# EAGLE design Wiegand (EAGLE 6.5.0)
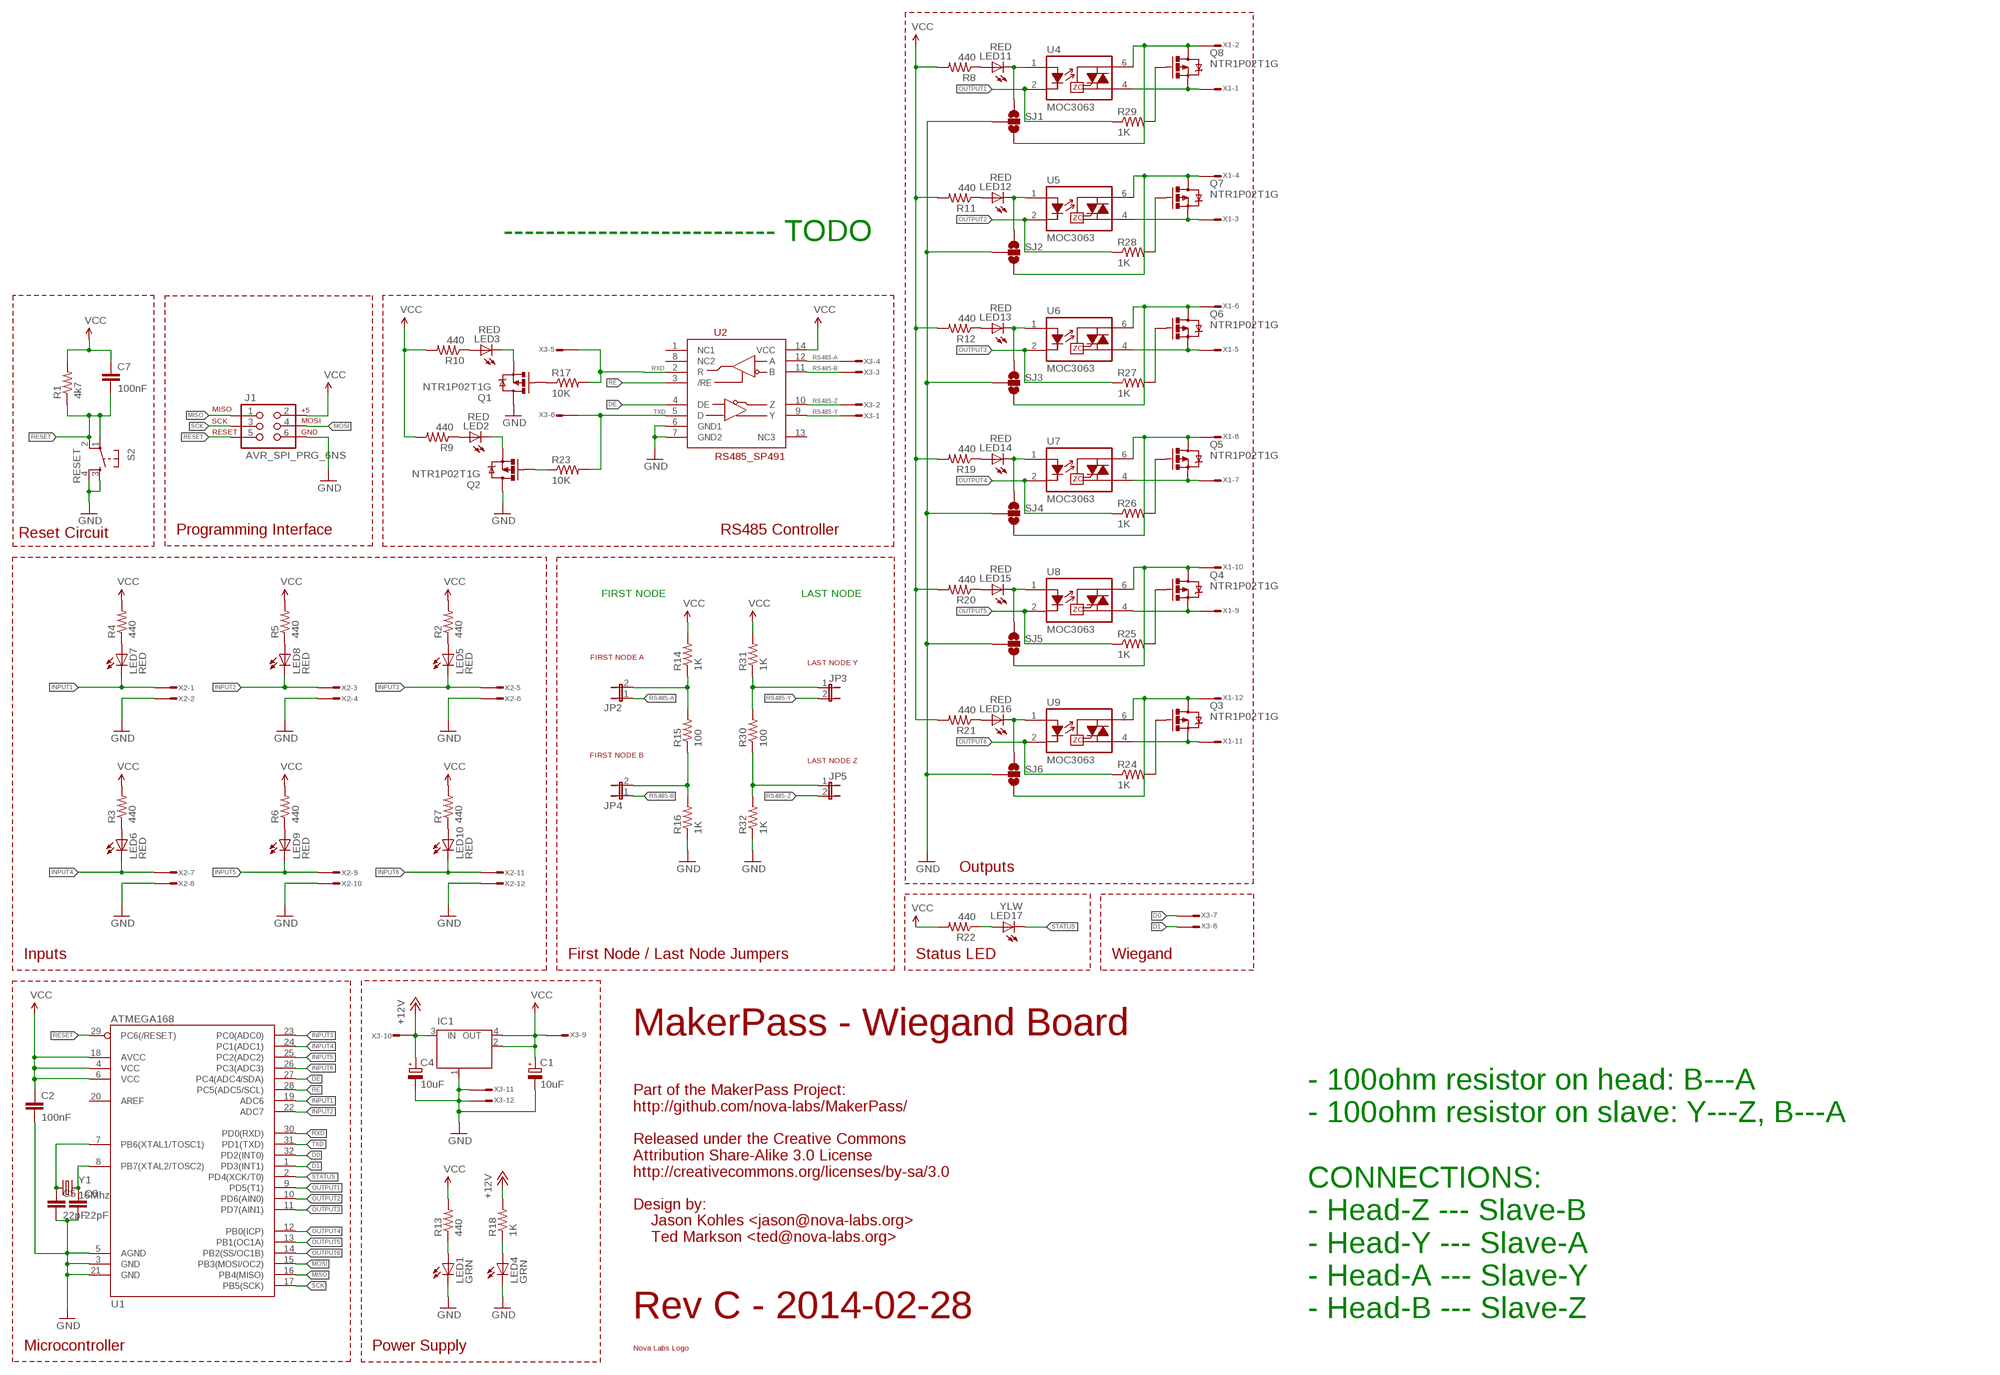
[diagram p0: schematic, sheet 1]

## Parts
C1  10uF  CPOL-EUD  [PANASONIC_D]
C2  100nF  CAP0603-CAP  [0603-CAP]
C4  10uF  CPOL-EUD  [PANASONIC_D]
C5  22pF  CAP0603-CAP  [0603-CAP]
C6  22pF  CAP0603-CAP  [0603-CAP]
C7  100nF  CAP0603-CAP  [0603-CAP]
IC1  MC33269ST-3.3T3  [SOT223]
J1  AVR_SPI_PRG_6NS  [2X3-NS]
JP2  JUMPER-2PTH  [1X02]
JP3  JUMPER-2PTH  [1X02]
JP4  JUMPER-2PTH  [1X02]
JP5  JUMPER-2PTH  [1X02]
LED1  GRN  LED-0805  [LED-805]
LED2  RED  LED-0805  [LED-805]
LED3  RED  LED-0805  [LED-805]
LED4  GRN  LED-0805  [LED-805]
LED5  RED  LED-0805  [LED-805]
LED6  RED  LED-0805  [LED-805]
LED7  RED  LED-0805  [LED-805]
LED8  RED  LED-0805  [LED-805]
LED9  RED  LED-0805  [LED-805]
LED10  RED  LED-0805  [LED-805]
LED11  RED  LED-0805  [LED-805]
LED12  RED  LED-0805  [LED-805]
LED13  RED  LED-0805  [LED-805]
LED14  RED  LED-0805  [LED-805]
LED15  RED  LED-0805  [LED-805]
LED16  RED  LED-0805  [LED-805]
LED17  YLW  LED-0805  [LED-805]
Q1  NTR1P02T1G  MOSFET-PCHANNELSMD  [SOT23-3]
Q2  NTR1P02T1G  MOSFET-PCHANNELSMD  [SOT23-3]
Q3  NTR1P02T1G  MOSFET-PCHANNELSMD  [SOT23-3]
Q4  NTR1P02T1G  MOSFET-PCHANNELSMD  [SOT23-3]
Q5  NTR1P02T1G  MOSFET-PCHANNELSMD  [SOT23-3]
Q6  NTR1P02T1G  MOSFET-PCHANNELSMD  [SOT23-3]
Q7  NTR1P02T1G  MOSFET-PCHANNELSMD  [SOT23-3]
Q8  NTR1P02T1G  MOSFET-PCHANNELSMD  [SOT23-3]
R1  4k7  RESISTOR0603-RES  [0603-RES]
R2  440  RESISTOR0603-RES  [0603-RES]
R3  440  RESISTOR0603-RES  [0603-RES]
R4  440  RESISTOR0603-RES  [0603-RES]
R5  440  RESISTOR0603-RES  [0603-RES]
R6  440  RESISTOR0603-RES  [0603-RES]
R7  440  RESISTOR0603-RES  [0603-RES]
R8  440  RESISTOR0603-RES  [0603-RES]
R9  440  RESISTOR0603-RES  [0603-RES]
R10  440  RESISTOR0603-RES  [0603-RES]
R11  440  RESISTOR0603-RES  [0603-RES]
R12  440  RESISTOR0603-RES  [0603-RES]
R13  440  RESISTOR0603-RES  [0603-RES]
R14  1K  RESISTOR0603-RES  [0603-RES]
R15  100  RESISTOR0603-RES  [0603-RES]
R16  1K  RESISTOR0603-RES  [0603-RES]
R17  10K  RESISTOR0603-RES  [0603-RES]
R18  1K  RESISTOR0603-RES  [0603-RES]
R19  440  RESISTOR0603-RES  [0603-RES]
R20  440  RESISTOR0603-RES  [0603-RES]
R21  440  RESISTOR0603-RES  [0603-RES]
R22  440  RESISTOR0603-RES  [0603-RES]
R23  10K  RESISTOR0603-RES  [0603-RES]
R24  1K  RESISTOR0603-RES  [0603-RES]
R25  1K  RESISTOR0603-RES  [0603-RES]
R26  1K  RESISTOR0603-RES  [0603-RES]
R27  1K  RESISTOR0603-RES  [0603-RES]
R28  1K  RESISTOR0603-RES  [0603-RES]
R29  1K  RESISTOR0603-RES  [0603-RES]
R30  100  RESISTOR0603-RES  [0603-RES]
R31  1K  RESISTOR0603-RES  [0603-RES]
R32  1K  RESISTOR0603-RES  [0603-RES]
S2  RESET  TAC_SWITCHSMD  [TACTILE_SWITCH_SMD]
SJ1  SOLDERJUMPER_2WAY-TRACE1&2&3  [SJ_3_WIRE1&2&3]
SJ2  SOLDERJUMPER_2WAY-TRACE1&2&3  [SJ_3_WIRE1&2&3]
SJ3  SOLDERJUMPER_2WAY-TRACE1&2&3  [SJ_3_WIRE1&2&3]
SJ4  SOLDERJUMPER_2WAY-TRACE1&2&3  [SJ_3_WIRE1&2&3]
SJ5  SOLDERJUMPER_2WAY-TRACE1&2&3  [SJ_3_WIRE1&2&3]
SJ6  SOLDERJUMPER_2WAY-TRACE1&2&3  [SJ_3_WIRE1&2&3]
U1  ATMEGA168  [TQFP32-08]
U2  RS485_SP491  [SOIC-14]
U4  MOC3063  MOC3063S  [DIP8SMD]
U5  MOC3063  MOC3063S  [DIP8SMD]
U6  MOC3063  MOC3063S  [DIP8SMD]
U7  MOC3063  MOC3063S  [DIP8SMD]
U8  MOC3063  MOC3063S  [DIP8SMD]
U9  MOC3063  MOC3063S  [DIP8SMD]
X1  CON-1X12-TERMBLOCK-3.5MM  [CON-1X12-TERMBLOCK-3.5MM]
X2  CON-1X12-TERMBLOCK-3.5MM  [CON-1X12-TERMBLOCK-3.5MM]
X3  CON-1X12-TERMBLOCK-3.5MM  [CON-1X12-TERMBLOCK-3.5MM]
X4  NOVA-LABS-LOGO-SILK-400MIL  [NOVA-LABS-LOGO-SILK-400MIL]
Y1  16Mhz  CRYSTALSMD  [HC49UP]

## Nets
+12V [power]: C4.+ IC1.3(IN) R18.2 X3.10
D0: U1.32(PD2(INT0)) X3.7
D1: U1.1(PD3(INT1)) X3.8
DE: U1.27(PC4(ADC4/SDA)) U2.4(DE)
GND: C1.- C2.2 C4.- C5.2 C6.2 IC1.1(GND/ADJ) J1.6 LED1.C LED4.C Q1.3(D) Q2.3(D) R16.1 R32.1 S2.3 S2.4 SJ1.2 SJ2.2 SJ3.2 SJ4.2 SJ5.2 SJ6.2 U1.3(GND) U1.5(AGND) U1.21(GND) U2.6(GND1) U2.7(GND2) X2.2 X2.4 X2.6 X2.8 X2.10 X2.12 X3.11 X3.12
INPUT1: LED7.C U1.19(ADC6) X2.1
INPUT2: LED8.C U1.22(ADC7) X2.3
INPUT3: LED5.C U1.23(PC0(ADC0)) X2.5
INPUT4: LED6.C U1.24(PC1(ADC1)) X2.7
INPUT5: LED9.C U1.25(PC2(ADC2)) X2.9
INPUT6: LED10.C U1.26(PC3(ADC3)) X2.11
MISO: J1.1 U1.16(PB4(MISO))
MOSI: J1.4 U1.15(PB3(MOSI/OC2))
N$1: LED1.A R13.1
N$3: Q4.2(S) U8.4(T2) X1.9
N$4: Q4.3(D) SJ5.3 U8.6(T1) X1.10
N$5: LED5.A R2.1
N$6: JP5.1 R30.1 R32.2
N$7: JP3.1 R30.2 R31.1
N$8: LED4.A R18.1
N$9: LED3.C Q1.2(S)
N$10: LED6.A R3.1
N$11: LED7.A R4.1
N$12: LED8.A R5.1
N$13: LED9.A R6.1
N$14: LED10.A R7.1
N$15: LED11.C SJ1.1 U4.1(A)
N$16: LED11.A R8.1
N$18: Q8.3(D) SJ1.3 U4.6(T1) X1.2
N$19: Q7.2(S) U5.4(T2) X1.3
N$20: Q7.3(D) SJ2.3 U5.6(T1) X1.4
N$21: LED12.A R11.1
N$22: LED12.C SJ2.1 U5.1(A)
N$23: Q6.2(S) U6.4(T2) X1.5
N$24: Q6.3(D) SJ3.3 U6.6(T1) X1.6
N$25: LED13.A R12.1
N$26: LED2.A R9.1
N$27: LED3.A R10.1
N$28: LED13.C SJ3.1 U6.1(A)
N$29: Q5.2(S) U7.4(T2) X1.7
N$30: Q5.3(D) SJ4.3 U7.6(T1) X1.8
N$31: LED14.A R19.1
N$32: LED14.C SJ4.1 U7.1(A)
N$33: LED2.C Q2.2(S)
N$34: Q1.1(G) R17.1
N$35: LED15.A R20.1
N$36: LED15.C SJ5.1 U8.1(A)
N$37: Q3.3(D) SJ6.3 U9.6(T1) X1.12
N$38: Q3.2(S) U9.4(T2) X1.11
N$39: LED16.A R21.1
N$40: LED16.C SJ6.1 U9.1(A)
N$41: LED17.A R22.1
N$42: Q2.1(G) R23.1
N$43: Q4.1(G) R25.2
N$44: Q5.1(G) R26.2
N$48: Q6.1(G) R27.2
N$49: Q7.1(G) R28.2
N$50: Q8.1(G) R29.2
N$51: JP2.2 R14.1 R15.2
N$52: JP4.2 R15.1 R16.2
N$53: Q8.2(S) U4.4(T2) X1.1
N$100: C5.1 U1.7(PB6(XTAL1/TOSC1)) Y1.1
N$101: C6.1 U1.8(PB7(XTAL2/TOSC2)) Y1.2
N$435: Q3.1(G) R24.2
OUTPUT1: R29.1 U1.9(PD5(T1)) U4.2(K)
OUTPUT2: R28.1 U1.10(PD6(AIN0)) U5.2(K)
OUTPUT3: R27.1 U1.11(PD7(AIN1)) U6.2(K)
OUTPUT4: R26.1 U1.12(PB0(ICP)) U7.2(K)
OUTPUT5: R25.1 U1.13(PB1(OC1A)) U8.2(K)
OUTPUT6: R24.1 U1.14(PB2(SS/OC1B)) U9.2(K)
RE: U1.28(PC5(ADC5/SCL)) U2.3(/RE)
RESET: C7.2 J1.5 R1.1 S2.1 S2.2 U1.29(PC6(/RESET))
RS485-A: JP2.1 U2.12(A) X3.4
RS485-B: JP4.1 U2.11(B) X3.3
RS485-Y: JP3.2 U2.9(Y) X3.1
RS485-Z: JP5.2 U2.10(Z) X3.2
RXD: R17.2 U1.30(PD0(RXD)) U2.2(R) X3.5
SCK: J1.3 U1.17(PB5(SCK))
STATUS: LED17.C U1.2(PD4(XCK/T0))
TXD: R23.2 U1.31(PD1(TXD)) U2.5(D) X3.6
VCC: C1.+ C2.1 C7.1 IC1.2(OUT) IC1.4(OUT) J1.2 R1.2 R2.2 R3.2 R4.2 R5.2 R6.2 R7.2 R8.2 R9.2 R10.2 R11.2 R12.2 R13.2 R14.2 R19.2 R20.2 R21.2 R22.2 R31.2 U1.4(VCC) U1.6(VCC) U1.18(AVCC) U2.14(VCC) X3.9
Unconnected: U1.20(AREF) U2.1(NC1) U2.8(NC2) U2.13(NC3)

## Notes on the sheet
- -------------------------- TODO
- Reset Circuit | Programming Interface | RS485 Controller
- FIRST NODE | LAST NODE
- FIRST NODE A
- LAST NODE Y
- FIRST NODE B
- LAST NODE Z
- Outputs
- Inputs | First Node / Last Node Jumpers | Status LED | Wiegand
- MakerPass - Wiegand Board
- Part of the MakerPass Project:
  http://github.com/nova-labs/MakerPass/
  
  Released under the Creative Commons
  Attribution Share-Alike 3.0 License
  http://creativecommons.org/licenses/by-sa/3.0
  
  Design by:
      Jason Kohles <jason@nova-labs.org>
      Ted Markson <ted@nova-labs.org>
- Rev C - 2014-02-28
- - 100ohm resistor on head: B---A
  - 100ohm resistor on slave: Y---Z, B---A
  
  CONNECTIONS:
  - Head-Z --- Slave-B
  - Head-Y --- Slave-A
  - Head-A --- Slave-Y
  - Head-B --- Slave-Z
- Microcontroller | Power Supply

## Library data of the parts
C1 C4 = rcl:CPOL-EU: POLARIZED CAPACITOR, European symbol; MFG_PN: EMVA250ADA100MD55G
C2 C7 = SparkFun:CAP: Capacitor Standard 0603 ceramic capacitor, and 0.1" leaded capacitor.; MFG_PN: 0603YC104KAT2A
C5 C6 = SparkFun:CAP: Capacitor Standard 0603 ceramic capacitor, and 0.1" leaded capacitor.; MFG_PN: 06035A220JAT2A
IC1 = linear:MC33269ST*: Adjustable Output Low Dropout Voltage Regulator 800 mA Source: http://www.onsemi.com/pub/Collateral/MC33269-D.PDF; MFG_PN: NCP1117ST50T3G
J1 = SparkFun-Connectors:AVR_SPI_PRG_6: AVR ISP 6 Pin This is the reduced ISP connector for AVR programming. Common on Arduino. This footprint will take up less PCB space and can be used with a 10-pin to 6-pin adapter such as SKU: BOB-08508
JP2-JP5 = SparkFun:JUMPER-2: Jumper Basic 0.1" spaced jumper. Use with breakaway headers.; MFG_PN: 1x2 pin header
LED1 LED4 = dp_devices:LED: Light Emitting Diode; MFG_PN: LG R971-KN-1
LED2 LED3 LED5-LED16 = dp_devices:LED: Light Emitting Diode; MFG_PN: LH R974-LP-1
LED17 = dp_devices:LED: Light Emitting Diode; MFG_PN: LY R976-PS-36
Q1-Q8 = SparkFun:MOSFET-PCHANNEL; MFG_PN: NTR1P02T1G
R1 = SparkFun:RESISTOR: Resistor Basic schematic elements and footprints for 0603, 1206, and PTH resistors.; MFG_PN: ERJ-3GEYJ472V
R2-R13 R17 R19-R23 = SparkFun:RESISTOR: Resistor Basic schematic elements and footprints for 0603, 1206, and PTH resistors.; MFG_PN: ERJ3EKF3300V
R14-R16 R18 R24-R32 = SparkFun:RESISTOR: Resistor Basic schematic elements and footprints for 0603, 1206, and PTH resistors.; MFG_PN: ERJ-3EKF1001V
S2 = SparkFun:TAC_SWITCH: Momentary Switch Button commonly used for reset or general input. Spark Fun Electronics SKU : COM-00097; MFG_PN: PTS525SM10SMTRLFS
SJ1-SJ6 = LumisenseV6:SOLDERJUMPER_2WAY: Solder Jumper 2 way solder jumper
U1 = SparkFun-DigitalIC:ATMEGA168: Atmel 32-pin 8-bit micro, 16k flash.; MFG_PN: ATMEGA168-20AU
U2 = SparkFun:RS485_SP491; MFG_PN: SP491EEN-L
U4-U9 = SparkFun-DiscreteSemi:MOC3063*: Optotriac in DIP and SMD LED: Vf: 1.2V If: 5 mA TRIAC Vdrm: 600V Itsm: 1A Viso: 5000V DV/dt: 1500V/us DIP: MOC3063 SMD: MOC3063S; MFG_PN: MOC3063S-TA1
X1-X3 = LumisenseV6:CON-1X12: CON-1X12; MFG_PN: OSTTE120104
X4 = NOVA-LABS-LOGO:NOVA-LABS-LOGO: Nova Labs Logos
Y1 = SparkFun:CRYSTAL: Crystals Various standard crystals. Proven footprints. Spark Fun Electronics SKU : COM-00534; MFG_PN: FOXSDLF/160-20

## Board
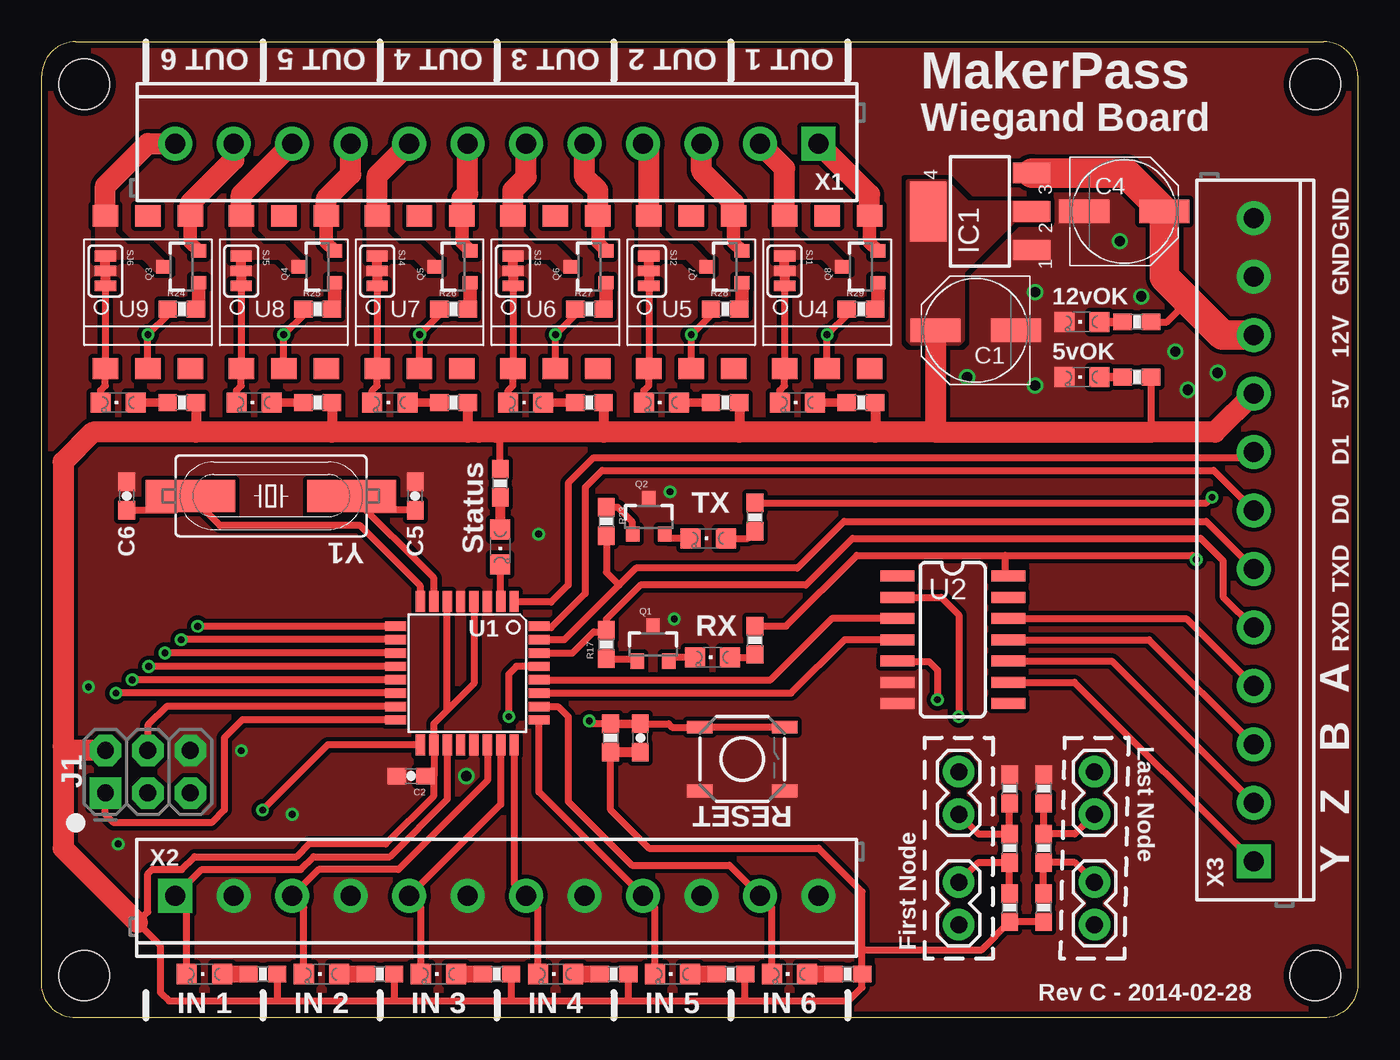
[diagram p1: board, top side]
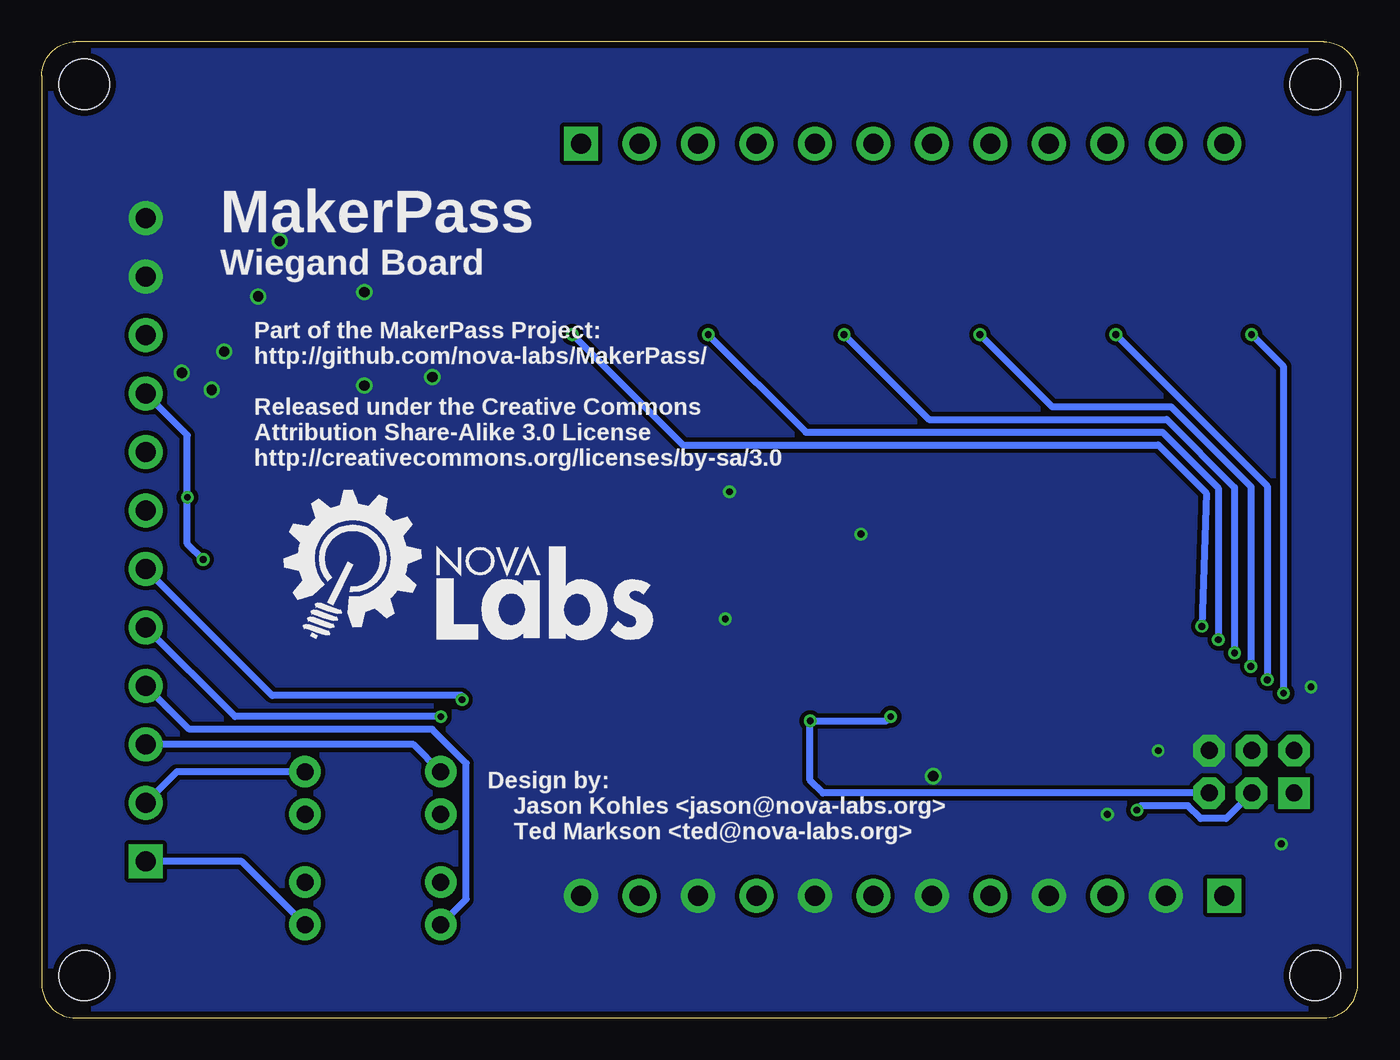
[diagram p2: board, bottom side, seen from below]

Size 78.74 x 58.42 mm. Coordinates in mm from the lower left corner, seen from the top.
Outline: 0,2.03 0,56.39 arc-90 2.03,58.42 76.71,58.42 arc-90 78.74,56.39 78.74,2.03 arc-90 76.71,0 2.03,0 arc-90 0,2.03
Copper layers (1*16): Top 0.0356mm / dielectric 1.5011mm / Bottom 0.0356mm
Design rules "OSHPark": minimum track width 6mil, minimum drill 13mil, track to track 6mil, track to pad 6mil, pad to pad 6mil, via to via 6mil, smd to smd 6mil, copper to edge 15mil, drill to drill 6mil, minimum pad ring 7mil, minimum via ring 7mil, stop-mask expansion 3mil, vias tented up to drill 0mil, thermal gap 10mil
Holes 3 mm at 2.54,2.54 76.2,2.54 2.54,55.88 76.2,55.88
tKeepout: area -0.5,-0.5 to 5.5,5.5; area 73.2,-0.5 to 79.2,5.5; area -0.5,52.9 to 5.5,58.9; area 73.2,52.9 to 79.2,58.9
bKeepout: area -0.5,-0.5 to 5.5,5.5; area 73.2,-0.5 to 79.2,5.5; area -0.5,52.9 to 5.5,58.9; area 73.2,52.9 to 79.2,58.9

### Footprints (pad centres in the part's own frame; a part is rotated, then mirrored left to right if it is on the bottom)
PANASONIC_D = smd 3 x 1.4: + 2.4,0; - -2.4,0
0603-CAP = smd 1.1 x 1: 1 -0.85,0; 2 0.85,0
SOT223 = smd 1.219 x 2.235: 1 -2.311,-3.099; 2 0,-3.099; 3 2.311,-3.099 | smd 3.6 x 2.2: 4 0,3.099
2X3-NS = drill 1.016 pad 1.88 square: 1 -2.54,-1.27 | drill 1.016 pad 1.88 octagon: 2 -2.54,1.27; 3 0,-1.27; 4 0,1.27; 5 2.54,-1.27; 6 2.54,1.27
1X02 = drill 1.016 pad 1.88: 1 0,0; 2 2.54,0
LED-805 = smd 1.2 x 1.2: A 0,-1.05; C 0,1.05
SOT23-3 = smd 0.8 x 0.9: 1 -0.95,-1; 2 0.95,-1; 3 0,1.1
0603-RES = smd 1.1 x 1: 1 -0.85,0; 2 0.85,0
TACTILE_SWITCH_SMD = smd 1.524 x 0.762: 1 -2.54,1.905; 2 2.54,1.905; 3 -2.54,-1.905; 4 2.54,-1.905
SJ_3_WIRE1&2&3 = smd 0.635 x 1.27: 1 -0.889,0; 2 0,0; 3 0.889,0
TQFP32-08 = smd 1.27 x 0.559: 1 -4.293,2.8; 2 -4.293,2; 3 -4.293,1.2; 4 -4.293,0.4; 5 -4.293,-0.4; 6 -4.293,-1.2; 7 -4.293,-2; 8 -4.293,-2.8; 17 4.293,-2.8; 18 4.293,-2; 19 4.293,-1.2; 20 4.293,-0.4; 21 4.293,0.4; 22 4.293,1.2; 23 4.293,2; 24 4.293,2.8 | smd 0.559 x 1.27: 9 -2.8,-4.293; 10 -2,-4.293; 11 -1.2,-4.293; 12 -0.4,-4.293; 13 0.4,-4.293; 14 1.2,-4.293; 15 2,-4.293; 16 2.8,-4.293; 25 2.8,4.293; 26 2,4.293; 27 1.2,4.293; 28 0.4,4.293; 29 -0.4,4.293; 30 -1.2,4.293; 31 -2,4.293; 32 -2.8,4.293
SOIC-14 = smd 0.66 x 2.032: 1 -4.445,-3.315; 2 -3.175,-3.315; 3 -1.905,-3.315; 4 -0.635,-3.315; 5 0.635,-3.315; 6 1.905,-3.315; 7 3.175,-3.315; 8 3.175,3.315; 9 1.905,3.315; 10 0.635,3.315; 11 -0.635,3.315; 12 -1.905,3.315; 13 -3.175,3.315; 14 -4.445,3.315
DIP8SMD = smd 1.524 x 1.27: 1 -2.54,-4.572; 2 0,-4.572; 3 2.54,-4.572; 4 2.54,4.572; 5 0,4.572; 6 -2.54,4.572
CON-1X12-TERMBLOCK-3.5MM = drill 1.2 pad 2.032 square: 1 0,0 | drill 1.2 pad 2.032: 2 3.5,0; 3 7,0; 4 10.5,0; 5 14,0; 6 17.5,0; 7 21,0; 8 24.5,0; 9 28,0; 10 31.5,0; 11 35,0; 12 38.5,0
HC49UP = smd 5.334 x 1.93: 1 -4.826,0; 2 4.826,0

### Placement (x,y rotation side)
C1  55.88,41.15 180 top
C2  22.1,14.48 180 top
C4  64.77,48.26 0 top
C5  22.35,31.24 90 top
C6  5.08,31.24 90 top
C7  35.81,16.76 90 top
IC1  56.13,48.26 90 top
J1  6.35,14.73 0 top
JP2  54.86,5.59 90 top
JP3  62.99,8.13 270 top
JP4  54.86,14.73 270 top
JP5  62.99,12.19 90 top
LED1  62.23,38.35 90 top
LED2  39.88,28.7 90 top
LED3  40.13,21.59 90 top
LED4  62.23,41.66 90 top
LED5  23.73,2.63 90 top
LED6  30.73,2.63 90 top
LED7  9.73,2.63 90 top
LED8  16.73,2.63 90 top
LED9  37.73,2.63 90 top
LED10  44.73,2.63 90 top
LED11  45.21,36.83 90 top
LED12  37.08,36.83 90 top
LED13  28.96,36.83 90 top
LED14  20.83,36.83 90 top
LED15  12.7,36.83 90 top
LED16  4.57,36.83 90 top
LED17  27.43,28.19 180 top
Q1  36.58,22.35 0 top
Q2  36.32,29.97 0 top
Q3  8.38,44.96 90 top
Q4  16.51,44.96 90 top
Q5  24.64,44.96 90 top
Q6  32.77,44.96 90 top
Q7  40.89,44.96 90 top
Q8  49.02,44.96 90 top
R1  34.04,16.76 270 top
R2  27.23,2.63 0 top
R3  34.23,2.63 0 top
R4  13.23,2.63 0 top
R5  20.23,2.63 0 top
R6  41.23,2.63 0 top
R7  48.23,2.63 0 top
R8  49.02,36.83 0 top
R9  42.67,29.97 90 top
R10  42.67,22.61 90 top
R11  40.89,36.83 0 top
R12  32.77,36.83 0 top
R13  65.53,38.35 0 top
R14  57.91,6.6 270 top
R15  57.91,10.16 270 top
R16  57.91,13.72 270 top
R17  33.78,22.35 90 top
R18  65.53,41.66 0 top
R19  24.64,36.83 0 top
R20  16.51,36.83 0 top
R21  8.38,36.83 0 top
R22  27.43,32 90 top
R23  33.78,29.72 270 top
R24  8.38,42.42 0 top
R25  16.51,42.42 0 top
R26  24.64,42.42 0 top
R27  32.77,42.42 0 top
R28  40.89,42.42 0 top
R29  49.02,42.42 0 top
R30  59.94,10.16 270 top
R31  59.94,6.6 270 top
R32  59.94,13.72 270 top
S2  41.91,15.49 0 top
SJ1  44.45,44.7 90 top
SJ2  36.32,44.7 90 top
SJ3  28.19,44.7 90 top
SJ4  20.07,44.7 90 top
SJ5  11.94,44.7 90 top
SJ6  3.81,44.7 90 top
U1  25.46,20.64 270 top
U2  54.51,22 270 top
U4  46.99,43.43 0 top
U5  38.86,43.43 0 top
U6  30.73,43.43 0 top
U7  22.61,43.43 0 top
U8  14.48,43.43 0 top
U9  6.35,43.43 0 top
X1  46.48,52.32 180 top
X2  7.98,7.3 0 top
X3  72.51,9.37 90 top
X4  64.26,22.61 0 bottom
Y1  13.72,31.24 180 top

### Tracks (layer width: path | path; a pad name or v marks a point on that pad's centre or on a via)
+12V
  Top 0.406: R18.2 67.31,41.66 68.58,42.93
  Top 1.778: IC1.3 64.86,50.57 C4.+ 67.17,44.34 68.58,42.93 70.63,40.87 X3.10
D0
  Top 0.406: 29.79,23.44 U1.32 29.83,23.37 30.48,23.37 32.51,25.4 32.51,31.75 33.53,32.77 70.12,32.77 X3.7
D1
  Top 0.406: X3.8 72.17,33.53 33.02,33.53 31.5,32 31.5,25.91 30.48,24.89 28.3,24.89 U1.1 28.49,24.93
DE
  Top 0.406: U2.4 48.03,22.64 44.84,19.44 U1.27
GND  (via drill 0.41, 0.61)
  other vias: 2.79,19.81 37.59,31.5 37.85,23.88 4.57,10.41 11.94,16 14.99,12.19 29.72,28.96 59.44,43.43 65.79,43.18 67.82,39.88 55.37,38.35 59.44,37.85 68.58,37.59 70.36,38.61 64.52,46.48 25.4,14.48
  pour Top (isolate 0.254, rank 6, no thermals): 0,0 78.74,0 78.74,58.42 0,58.42
  pour Bottom (isolate 0.254, no thermals): 0,0 78.74,0 78.74,58.42 0,58.42
INPUT1
  Top 0.406: U1.19 24.26,13.09 20.83,9.65 16.26,9.65 15.49,8.89 9.57,8.89 X2.1 8.68,6.6 LED7.C
INPUT2
  Top 0.406: U1.22 26.66,14.22 21.34,8.89 16.57,8.89 X2.3 15.68,6.6 LED8.C
INPUT3
  Top 0.406: U1.23 27.46,12.78 X2.5 22.68,6.6 LED5.C
INPUT4
  Top 0.406: U1.24 28.26,8.02 X2.7 29.68,6.6 LED6.C
INPUT5
  Top 0.406: U1.25 29.75,13.53 X2.9 36.68,6.6 LED9.C
INPUT6
  Top 0.406: U1.26 30.89,18.64 31.5,18.03 31.5,12.95 35.31,9.14 41.14,9.14 X2.11 43.68,6.6 LED10.C
MISO
  Top 0.406: U1.16 12,17.84 10.92,16.76 10.92,12.45 10.16,11.68 4.32,11.68 3.81,12.19 J1.1
MOSI
  Top 0.406: U1.15 7.46,18.64 6.35,17.53 J1.4
N$1
  Top 0.508: LED1.A R13.1
N$3
  Top 0.813: Q4.2 17.02,46.4 U8.4
  Top 1.27: U8.4 17.02,49.02 18.48,50.49 X1.9
N$4
  Top 1.27: U8.6 11.94,49.28 X1.10
  pour Top (no thermals): 15.75,44.7 14.99,44.7 14.22,45.47 11.43,45.47 11.43,48.51 12.45,48.51 12.45,48.26 12.45,46.99 13.21,46.23 14.48,46.23 15.49,45.21 15.75,45.21
N$5
  Top 1.016: R2.1 LED5.A
N$6
  Top 0.406: JP5.1 61.81,11.01 R30.1 R32.2
N$7
  Top 0.406: JP3.1 61.81,9.31 R30.2 R31.1
N$8
  Top 0.508: R18.1 LED4.A
N$9
  Top 0.406: LED3.C 37.76,21.59 Q1.2
N$10
  Top 1.016: R3.1 LED6.A
N$11
  Top 1.016: R4.1 LED7.A
N$12
  Top 1.016: R5.1 LED8.A
N$13
  Top 1.016: R6.1 LED9.A
N$14
  Top 1.016: R7.1 LED10.A
N$15
  Top 0.406: LED11.C 44.16,37.56 44.45,37.85 U4.1 SJ1.1
N$16
  Top 0.508: LED11.A R8.1
N$18
  Top 1.27: U4.6 44.45,50.86 X1.2
  pour Top (no thermals): 48.26,44.7 47.5,44.7 46.74,45.47 43.94,45.47 43.94,48.51 44.96,48.51 44.96,48.26 44.96,46.99 45.72,46.23 46.99,46.23 48.01,45.21 48.26,45.21
N$19
  Top 0.813: Q7.2 41.4,46.4 U5.4
  Top 1.27: U5.4 41.4,48.77 39.48,50.69 X1.3
N$20
  Top 1.27: U5.6 36.32,51.98 X1.4
  pour Top (no thermals): 40.13,44.7 39.37,44.7 38.61,45.47 35.81,45.47 35.81,48.51 36.83,48.51 36.83,48.26 36.83,46.99 37.59,46.23 38.86,46.23 39.88,45.21 40.13,45.21
N$21
  Top 0.508: LED12.A R11.1
N$22
  Top 0.406: LED12.C 36.03,37.56 36.32,37.85 U5.1 SJ2.1
N$23
  Top 0.813: Q6.2 33.27,46.4 U6.4
  Top 1.27: U6.4 33.27,49.53 32.48,50.32 X1.5
N$24
  Top 1.27: U6.6 28.19,49.53 28.98,50.32 X1.6
  pour Top (no thermals): 32,44.7 31.24,44.7 30.48,45.47 27.69,45.47 27.69,48.51 28.7,48.51 28.7,48.26 28.7,46.99 29.46,46.23 30.73,46.23 31.75,45.21 32,45.21
N$25
  Top 0.508: R12.1 LED13.A
N$26
  Top 0.406: LED2.A 42.25,28.7 R9.1
N$27
  Top 0.406: LED3.A 42.51,21.59 R10.1
N$28
  Top 0.406: LED13.C 27.91,37.56 28.19,37.85 U6.1 SJ3.1
N$29
  Top 0.813: Q5.2 25.15,46.4 U7.4
  Top 1.27: U7.4 25.15,49.02 25.48,49.36 X1.7
N$30
  Top 1.27: U7.6 20.07,50.41 X1.8
  pour Top (no thermals): 23.88,44.7 23.11,44.7 22.35,45.47 19.56,45.47 19.56,48.51 20.57,48.51 20.57,48.26 20.57,46.99 21.34,46.23 22.61,46.23 23.62,45.21 23.88,45.21
N$31
  Top 0.508: LED14.A R19.1
N$32
  Top 0.406: LED14.C 19.78,37.56 20.07,37.85 U7.1 SJ4.1
N$33
  Top 0.406: LED2.C 37.54,28.7 Q2.2
N$34
  Top 0.406: R17.1 35.48,21.5 Q1.1
N$35
  Top 0.508: LED15.A R20.1
N$36
  Top 0.406: LED15.C 11.65,37.56 11.94,37.85 U8.1 SJ5.1
N$37
  Top 1.27: U9.6 3.81,49.78 6.35,52.32 X1.12
  pour Top (no thermals): 7.62,44.7 6.86,44.7 6.1,45.47 3.3,45.47 3.3,48.51 4.32,48.51 4.32,48.26 4.32,46.99 5.08,46.23 6.35,46.23 7.37,45.21 7.62,45.21
N$38
  Top 0.813: Q3.2 8.89,46.4 U9.4
  Top 1.27: U9.4 8.89,48.77 11.48,51.36 X1.11
N$39
  Top 0.508: LED16.A R21.1
N$40
  Top 0.406: LED16.C 3.52,37.56 3.81,37.85 U9.1 SJ6.1
N$41
  Top 0.61: R22.1 LED17.A
N$42
  Top 0.406: R23.1 34.46,30.57 35.31,29.72 35.31,29.04 Q2.1
N$43
  Top 0.813: Q4.1 17.51,42.57 R25.2
N$44
  Top 0.813: Q5.1 25.64,42.57 R26.2
N$48
  Top 0.813: Q6.1 33.77,42.57 R27.2
N$49
  Top 0.813: Q7.1 41.89,42.57 R28.2
N$50
  Top 0.813: Q8.1 50.02,42.57 R29.2
N$51
  Top 0.406: R14.1 R15.2 56.05,9.31 JP2.2
N$52
  Top 0.406: R16.2 R15.1 56.05,11.01 JP4.2
N$53
  Top 0.813: Q8.2 49.53,46.4 U4.4
  Top 1.27: U4.4 49.53,49.28 X1.1
N$100
  Top 0.406: U1.7 23.46,26.32 Y1.1 19.39,30.39 C5.1
N$101
  Top 0.406: U1.8 22.66,25.85 19.05,29.46 10.67,29.46 Y1.2 8.04,30.39 C6.1
N$435
  Top 0.813: R24.2 9.38,42.57 Q3.1
OUTPUT1  (via drill 0.41)
  Top 0.406: U1.9 v9.33,23.44 | U4.2 v46.99,40.89 48.17,42.08 R29.1
  Bottom 0.406: v46.99,40.89 40.39,34.29 11.94,34.29 9.07,31.42 v9.33,23.44
OUTPUT2  (via drill 0.41)
  Top 0.406: U1.10 v8.35,22.64 | U5.2 v38.86,40.89 40.04,42.08 R28.1
  Bottom 0.406: v38.86,40.89 33.02,35.05 11.68,35.05 8.35,31.72 v8.35,22.64
OUTPUT3  (via drill 0.41)
  Top 0.406: U1.11 v7.37,21.84 | U6.2 v30.73,40.89 31.92,42.08 R27.1
  Bottom 0.406: v30.73,40.89 25.65,35.81 11.43,35.81 7.37,31.75 v7.37,21.84
OUTPUT4  (via drill 0.41)
  Top 0.406: U1.12 v6.39,21.04 | U7.2 v22.61,40.89 23.79,42.08 R26.1
  Bottom 0.406: v22.61,40.89 18.29,36.58 11.18,36.58 6.39,31.79 v6.39,21.04
OUTPUT5  (via drill 0.41)
  Top 0.406: U1.13 v5.41,20.24 | U8.2 v14.48,40.89 15.66,42.08 R25.1
  Bottom 0.406: v5.41,20.24 5.41,31.83 v14.48,40.89
OUTPUT6  (via drill 0.41)
  Top 0.406: U1.14 v4.44,19.44 | U9.2 v6.35,40.89 7.53,42.08 R24.1
  Bottom 0.406: v4.44,19.44 4.44,38.98 v6.35,40.89
RE
  Top 0.406: U1.28 43.61,20.24 47.27,23.91 U2.3
RESET  (via drill 0.41)
  Top 0.406: U1.29 28.41,21.04 27.94,20.57 v27.94,18.03 | R1.1 32.93,17.61 v32.77,17.78 | S2.2 S2.1 37.72,17.4 37.5,17.61 C7.2
  Top 0.508: C7.2 R1.1
  Bottom 0.406: v27.94,18.03 28.19,17.78 v32.77,17.78 32.77,14.22 32,13.46 J1.5
RS485-A
  Top 0.406: U2.12 68.48,23.91 X3.4
  Bottom 0.406: JP2.1 53.34,7.11 53.34,15.24 55.37,17.27 69.91,17.27 X3.4
RS485-B
  Top 0.406: U2.11 66.25,22.64 X3.3
  Bottom 0.406: JP4.1 56.5,16.37 X3.3
RS485-Y
  Top 0.406: U2.9 61.79,20.09 X3.1
  Bottom 0.406: JP3.2 66.78,9.37 X3.1
RS485-Z
  Top 0.406: U2.10 64.02,21.36 X3.2
  Bottom 0.406: JP5.2 70.65,14.73 X3.2
RXD  (via drill 0.41)
  Top 0.406: X3.5 70.68,25.21 70.68,27.37 69.34,28.7 48.51,28.7 45.72,25.91 35.81,25.91 33.78,23.88 R17.2 33.69,23.11 33.02,23.11 31.75,21.84 U1.30 | U2.2 53.82,25.18 54.86,24.13 v54.86,18.03
  Bottom 0.406: v54.86,18.03 67.18,18.03 X3.5
SCK  (via drill 0.41)
  Top 0.406: U1.17 17.11,16.35 v13.21,12.45
  Bottom 0.406: J1.3 7.87,11.94 9.4,11.94 10.16,12.7 12.95,12.7 v13.21,12.45
STATUS
  Top 0.406: U1.2 27.46,27.11 LED17.C
TXD  (via drill 0.41)
  Top 0.406: 50.55,21.34 51.17,21.34 | 51.17,21.34 U2.5 | 51.17,21.34 53.09,21.34 53.59,20.83 v53.59,19.05 | X3.6 69.67,29.72 48.01,29.72 45.21,26.92 35.56,26.92 34.54,25.91 | U1.31 31.28,22.64 34.54,25.91 | R23.2 33.78,26.67 34.54,25.91
  Bottom 0.406: X3.6 64.95,19.3 53.59,19.3 v53.59,19.05
VCC  (via drill 0.41)
  Top 0.406: 42.08,1.02 R6.2 | R3.2 35.08,1.02 | 35.08,1.02 42.08,1.02 | R2.2 28.08,1.02 | 28.08,1.02 35.08,1.02 | R5.2 21.08,1.02 | 21.08,1.02 28.08,1.02 | R4.2 14.08,1.02 | 14.08,1.02 21.08,1.02 | 14.08,1.02 7.62,1.02 7.11,1.52 7.11,4.32 5.71,5.71 6.35,6.35 6.35,8.64 6.6,8.89 8.38,8.89 9.14,9.65 15.24,9.65 16,10.41 20.57,10.41 23.46,13.3 23.46,14.48 | 25.86,34.75 26.16,35.05 | R22.2 27.43,34.8 27.18,35.05 | 35.65,15.91 R1.2 34.04,12.45 36.32,10.16 46.48,10.16 49.08,7.56 49.08,4.06 | 58.65,26.45 U2.14 57.8,26.42 57.66,26.55 57.66,27.69 | R10.2 44.54,23.46 48.77,27.69 57.66,27.69 | 57.66,27.69 68.83,27.69 v69.09,27.43 | R9.2 69.68,30.82 v70.03,31.17 | 66.38,35.05 R13.2 | 23.46,14.48 U1.18 23.46,17.62 24.26,18.42 | 23.46,14.48 C2.1 | 24.26,18.42 U1.6 | U1.4 25.86,20.02 24.26,18.42 | R31.2 R14.2 56.22,4.06 49.08,4.06 | 49.08,4.06 R7.2 49.08,1.84 48.26,1.02 42.08,1.02
  Top 0.61: R1.2 C7.1 | R8.2 49.87,35.05 | R11.2 41.74,35.05 | R12.2 33.62,35.05 | R19.2 25.49,35.05 | R20.2 17.36,35.05 | R21.2 9.23,35.05
  Top 1.27: 1.27,16.26 1.27,10.16 5.71,5.71 | 1.27,16.26 1.27,33.27 3.05,35.05 9.23,35.05 17.36,35.05 25.49,35.05 26.16,35.05 27.18,35.05 33.62,35.05 41.74,35.05 49.87,35.05 53.48,35.05 | J1.2 1.52,16 1.27,16.26 | C1.+ 53.48,35.05 | X3.9 70.19,35.05 66.38,35.05 53.48,35.05
  Bottom 0.406: X3.9 70.03,34.89 v70.03,31.17 70.03,28.37 v69.09,27.43
  pour Top (no thermals): 60.2,48.77 55.37,48.77 54.1,50.04 51.82,50.04 51.82,40.64 52.07,40.39 54.86,40.39 55.12,40.64 55.12,44.7 58.17,47.75 60.2,47.75

### Text on the board
tPlace: Status
bPlace: Wiegand Board
tNames: OUT 6 | OUT 5 | OUT 4 | OUT 3 | OUT 2 | OUT 1 | MakerPass | Wiegand Board | GND | 12vOK | GND | 5vOK | 12V | 5V | D1 | TX | D0 | TXD | RX | RXD | A | Last Node | B | RESET | Z | Y | First Node | Rev C - 2014-02-28 | IN 1 | IN 2 | IN 3 | IN 4 | IN 5 | IN 6
bNames: MakerPass | Part of the MakerPass Project: / http://github.com/nova-labs/MakerPass/ / / Released under the Creative Commons / Attribution Share-Alike 3.0 License / http://creativecommons.org/licenses/by-sa/3.0 | Design by: / Jason Kohles <jason@nova-labs.org> / Ted Markson <ted@nova-labs.org>